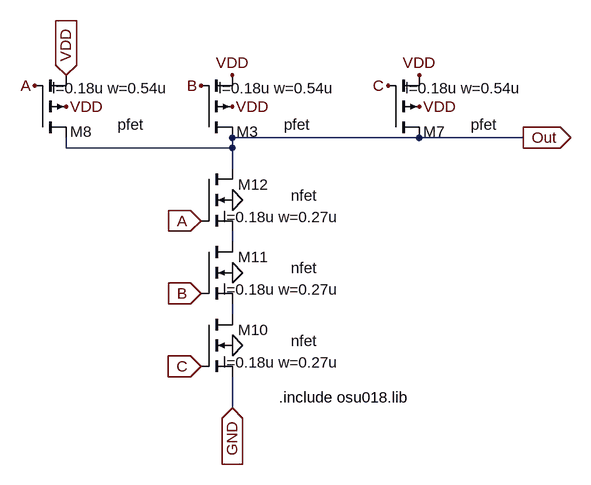
[diagram p0: schematic NAND_3.asc]
NAND_3.asc, the LTspice schematic file:
Version 4
SHEET 1 6288 680
WIRE 1456 -416 1168 -416
WIRE 1616 -416 1456 -416
WIRE 912 -400 912 -416
WIRE 1168 -400 1168 -416
WIRE 1168 -400 912 -400
WIRE 1168 -368 1168 -400
WIRE 1168 -256 1168 -272
WIRE 1168 -144 1168 -160
WIRE 1168 0 1168 -48
FLAG 1168 -464 VDD
FLAG 1456 -464 VDD
FLAG 912 -464 VDD
FLAG 1168 -96 0
FLAG 1168 -208 0
FLAG 1168 -320 0
FLAG 1168 -512 VDD
FLAG 1456 -512 VDD
FLAG 912 -512 VDD
IOPIN 912 -512 In
FLAG 1168 0 GND
IOPIN 1168 0 In
FLAG 1616 -416 Out
IOPIN 1616 -416 Out
FLAG 864 -496 A
FLAG 1120 -288 A
IOPIN 1120 -288 In
FLAG 1120 -496 B
FLAG 1120 -176 B
IOPIN 1120 -176 In
FLAG 1408 -496 C
FLAG 1120 -64 C
IOPIN 1120 -64 In
SYMBOL pmos4 1120 -416 M180
WINDOW 0 88 9 Right 2
WINDOW 3 168 20 Right 2
WINDOW 123 206 76 Right 2
SYMATTR InstName M3
SYMATTR Value pfet
SYMATTR Value2 l=0.18u w=0.54u
SYMBOL pmos4 1408 -416 M180
WINDOW 0 88 9 Right 2
WINDOW 3 168 20 Right 2
WINDOW 123 206 76 Right 2
SYMATTR InstName M7
SYMATTR Value pfet
SYMATTR Value2 l=0.18u w=0.54u
SYMBOL pmos4 864 -416 M180
WINDOW 0 88 9 Right 2
WINDOW 3 168 20 Right 2
WINDOW 123 206 76 Right 2
SYMATTR InstName M8
SYMATTR Value pfet
SYMATTR Value2 l=0.18u w=0.54u
SYMBOL nmos4 1120 -144 R0
WINDOW 0 104 24 Right 2
WINDOW 3 179 41 Right 2
WINDOW 123 213 74 Right 2
SYMATTR InstName M10
SYMATTR Value nfet
SYMATTR Value2 l=0.18u w=0.27u
SYMBOL nmos4 1120 -256 R0
WINDOW 0 104 24 Right 2
WINDOW 3 179 41 Right 2
WINDOW 123 213 74 Right 2
SYMATTR InstName M11
SYMATTR Value nfet
SYMATTR Value2 l=0.18u w=0.27u
SYMBOL nmos4 1120 -368 R0
WINDOW 0 104 24 Right 2
WINDOW 3 179 41 Right 2
WINDOW 123 213 74 Right 2
SYMATTR InstName M12
SYMATTR Value nfet
SYMATTR Value2 l=0.18u w=0.27u
TEXT 1240 -16 Left 2 !.include osu018.lib

The netlist it stands for:
* NAND_3.asc
M3 Out B VDD VDD pfet l=0.18u w=0.54u
M7 Out C VDD VDD pfet l=0.18u w=0.54u
M8 Out A VDD VDD pfet l=0.18u w=0.54u
M10 N002 C GND 0 nfet l=0.18u w=0.27u
M11 N001 B N002 0 nfet l=0.18u w=0.27u
M12 Out A N001 0 nfet l=0.18u w=0.27u
.model NMOS NMOS
.model PMOS PMOS
.lib standard.mos
.include osu018.lib
.backanno
.end